# Altium schematic sheet PWM_I2C.SchDoc
size A
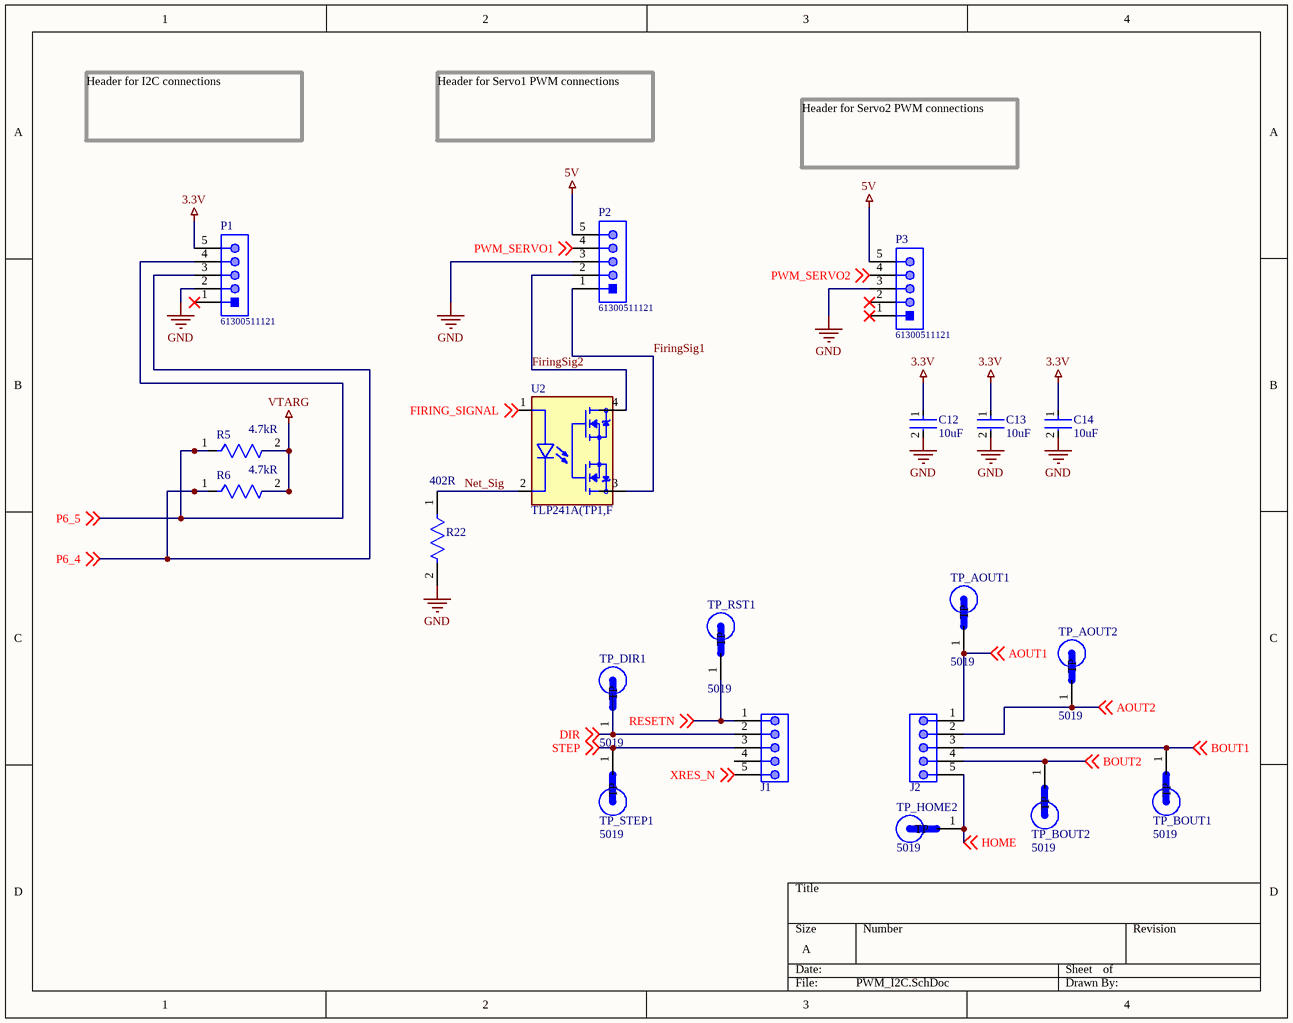
[diagram p0: PWM_I2C.SchDoc]

## Parts
C12  value 10uF  [FP-C0805C-DG-MFG]  (hidden comment: C0805C106K8PACTU)
C13  value 10uF  [FP-C0805C-DG-MFG]  (hidden comment: C0805C106K8PACTU)
C14  value 10uF  [FP-C0805C-DG-MFG]  (hidden comment: C0805C106K8PACTU)
J1  CONN_HEADER_MALE_1x5  [HDR1X5]  (value not drawn)
J2  CONN_HEADER_MALE_1x5  [HDR1X5]  (value not drawn)
P1  61300511121  [61300511121]
P2  61300511121  [61300511121]
P3  61300511121  [61300511121]
R5  Resistance: 4.7kR  [FP-RMCF0805-MFG]  (hidden comment: RMCF0805JT4K70)
R6  Resistance: 4.7kR  [FP-RMCF0805-MFG]  (hidden comment: RMCF0805JT4K70)
R22  Resistance: 402R  [FP-RMCF0805-IPC_C]  (hidden comment: RMCF0805FT402R)
TP_AOUT1  5019  [TP380X203]
TP_AOUT2  5019  [TP380X203]
TP_BOUT1  5019  [TP380X203]
TP_BOUT2  5019  [TP380X203]
TP_DIR1  5019  [TP380X203]
TP_HOME2  5019  [TP380X203]
TP_RST1  5019  [TP380X203]
TP_STEP1  5019  [TP380X203]
U2  TLP241A(TP1,F  [SOIC254P1000X425-4N]

## Nets
3.3V: C12.1 C13.1 C14.1 P1.5
5V: P2.5 P3.5
GND: C12.2 C13.2 C14.2 P1.2 P2.3 P3.3 R22.2
VTARG: R5.2 R6.2
AOUT1: J2.1 TP_AOUT1.1(TP) ; off-sheet AOUT1
AOUT2: J2.2 TP_AOUT2.1(TP) ; off-sheet AOUT2
BOUT1: J2.3 TP_BOUT1.1(TP) ; off-sheet BOUT1
BOUT2: J2.4 TP_BOUT2.1(TP) ; off-sheet BOUT2
DIR: J1.2 TP_DIR1.1(TP) ; off-sheet DIR
FIRING_SIGNAL: U2.1(A) ; off-sheet FIRING_SIGNAL
FiringSig1: P2.1 U2.3(D1)
FiringSig2: P2.2 U2.4(D2)
HOME: J2.5 TP_HOME2.1(TP) ; off-sheet HOME
Net_Sig: R22.1 U2.2(C)
P6_4: P1.3 R6.1 ; off-sheet P6_4
P6_5: P1.4 R5.1 ; off-sheet P6_5
PWM_SERVO1: P2.4 ; off-sheet PWM_SERVO1
PWM_SERVO2: P3.4 ; off-sheet PWM_SERVO2
RESETN: J1.1 TP_RST1.1(TP) ; off-sheet RESETN
STEP: J1.3 TP_STEP1.1(TP) ; off-sheet STEP
XRES_N: J1.5 ; off-sheet XRES_N

Not connected (* = marked no-connect by the designer): J1 4; P1 1*; P3 1* 2*

## Notes on the sheet
- Header for I2C connections
- Header for Servo1 PWM connections
- Header for Servo2 PWM connections

## Library data of the parts
C12-C14 = CMP-2007-03243-2: CAP CER 10UF 10V X5R 0805; Manufacturer: Kemet; 3DS Part Number: 220-00001; Tolerance: 10%; Temperature Coefficient: 15%; Material: Ceramic; Device Class L2: Capacitors; Device Class L1: Passive Components; ComponentLink2URL: https://content.kemet.com/datasheets/KEM_C1006_X5R_SMD.pdf; Height: 1.4mm; Lead Free: Yes; Manufacturer Part Number: C0805C106K8PACTU; Digikey Description: CAP CER 10UF 10V X5R 0805; Octopart: https://octopart.com/c0805c106k8pactu-kemet-98697; Capacitance: 10uF; Temperature Range Low: -55°C; Temperature: -55°C to +85°C; Automotive: No; Mouser Description: CAP CER 10UF 10V X5R 0805; Ipc Land Pattern Name: CAPC200125X125; Temperature Range High: +85°C; Voltage: 10V; RoHS: TRUE; Device Class L3: Ceramic Capacitors; ComponentLink2Description: Datasheet; Voltage Rating: 10V; Package: C0805C-DG; Temperature Characteristic: X5R; Category: Cap; Supplier 1: Digi-Key; Supplier Part Number 1: 399-C0805C106K8PAC7800CT-ND; Manufacturer 1: KEMET; Manufacturer Part Number 1: C0805C106K8PACTU; Stock 1: 8631846; Pricing 1: 1=0.14000, 10=0.10300, 50=0.05840, 100=0.04830, 500=0.03388, 1000=0.02805 (USD); Mount: Surface Mount; Case/Package: 0805; Number of Pins: 2; Case Code (Imperial): 0805; Case Code (Metric): 2012; Dielectric Material: Ceramic; Contact Plating: Tin,Matte; Min Operating Temperature: -55°C; Max Operating Temperature: 85°C; Packaging: Tape and Reel; Dielectric: X5R; Package Quantity: 1; Voltage Rating (DC): 10V; Series: C; Termination: SMD/SMT; Construction: Flat; Dissipation Factor: 10%; Length: 2mm; Width: 1.2mm; Depth: 1.25mm; Thickness: 0.055inch; Radiation Hardening: No; REACH SVHC: No SVHC; RoHS Compliant: Yes
J1 J2 = CONN_HEADER_MALE_1x5: Header, 5-Pin; Manufacturer 1: Sullins; Manufacturer Part Number 1: PREC005SACN-RC; Number of Positions: 5; Connector Type: Male Pin; Pitch: 0.1inch; ComponentLink1URL: http://www.farnell.com/cad/1737268.pdf; ComponentLink1Description: http://www.farnell.com/cad/1737268.pdf; ComponentLink2URL: http://katalog.we-online.de/em/datasheet/6130xx11121.pdf; ComponentLink2Description: http://katalog.we-online.de/em/datasheet/6130xx11121.pdf; Supplier 1: Digi-Key; Stock 1: 0; Pricing 1: 1=0.19000, 10=0.17400, 25=0.12960, 50=0.11120, 100=0.10740, 250=0.09264, 500=0.08892 (USD); RoHS: Yes; Mount: Through Hole; Color: Black; Contact Plating: Tin; Package Quantity: 1; Number of Rows: 1; Packaging: Bulk; Termination: Solder; Contact Mating Length: 0.23inch; ComponentLink3URL: https://datasheet.ciiva.com/741/xrxczzzsxxn-rc-st-11635-b-741840.pdf?src-supplier=Digi-Key; ComponentLink3Description: https://datasheet.ciiva.com/741/xrxczzzsxxn-rc-st-11635-b-741840.pdf?src-supplier=Digi-Key; Supplier Part Number 1: S1032EC-05-ND
P1-P3 = CMP-1502-01068-1: THT Vertical Pin Header WR-PHD, Pitch 2.54 mm, Single Row, 5 pins; Manufacturer: Wurth Elektronik; Manufacturer 1: Wurth Electronics; Pin Number: 5; Contact Resistance: 20mOhm; Working Voltage: 250VAC; Pitch: 2.54mm; Withstanding Voltage: 500VAC; Rated Current: 3A; Gender: Male; Connector Type: Male Pin; Datasheet URL: https://katalog.we-online.de/em/datasheet/6130xx11121.pdf; Orientation: Vertical; Mounting Technology: THT; Row Number: Single; Package Reference: 61300511121; Publisher: WurthElektronik; Part Number: 61300511121; Packaging: Bag; Manufacturer URL: http://www.we-online.de; Operating Temperature: -40to105degC; Supplier 1: Digi-Key; Supplier Part Number 1: 732-5318-ND; Manufacturer Part Number 1: 61300511121; RoHS: Yes; Category: Headers and Wire Housings; Stock 1: 41302; Pricing 1: 1=0.26000, 10=0.22200, 25=0.18520, 50=0.15500, 100=0.14100, 1000=0.12800 (USD); Mount: Through Hole; Contact Plating: Gold; Contact Material: Copper; Color: Black; Number of Rows: 1; Termination: Solder; Number of Contacts: 5; Number of Positions: 5; Contact Mating Length: 0.236inch; RoHS Compliant: Yes; REACH SVHC: Unknown; Lead Free: Lead Free; ComponentLink1URL: http://www.farnell.com/cad/1737268.pdf?src-supplier=Element14; ComponentLink1Description: http://www.farnell.com/cad/1737268.pdf?src-supplier=Element14; ComponentLink2URL: https://katalog.we-online.de/em/datasheet/6130xx11121.pdf?src-supplier=Digi-Key; ComponentLink2Description: https://katalog.we-online.de/em/datasheet/6130xx11121.pdf?src-supplier=Digi-Key
R5 R6 = CMP-26527-003538-1: 4.7kΩ ±5% 0.125W 0805 Thick Film Chip Resistor AEC-Q200 compliant; Manufacturer: Stackpole Electronics; Temperature Coefficient: 100ppm/°C; Max Power Dissipation: 125mW; Size Code: 0805; Case/Package: 0805; Mount: Surface Mount; RoHS Compliant: Yes; Height: 0.026inch; Case Code (Imperial): 0805; Military Standard: Not; Contact Plating: Tin; Length: 2mm; Resistor Type: Thick Film; Tolerance: 5%; Depth: 1.25mm; Radiation Hardening: No; Min Operating Temperature: -55°C; Number of Terminations: 2; Width: 0.049inch; Lead Free: Lead Free; Case Code (Metric): 2012; Construction: Rectangular; Packaging: Tape and Reel; Features: Automotive AEC-Q200; Power Rating: 125mW; Max Operating Temperature: 155°C; Series: RMCF; Supplier 1: Digi-Key; Supplier Part Number 1: RMCF0805JT4K70CT-ND; Manufacturer Part Number: RMCF0805JT4K70; RoHS: Yes; Category: Chip SMD Resistors; Stock 1: 1600707; Pricing 1: 1=0.10000, 10=0.01800, 100=0.00730, 1000=0.00328, 2500=0.00284 (USD); ComponentLink1URL: https://www.seielect.com/catalog/SEI-RMCF_RMCP.pdf?src-supplier=Avnet; ComponentLink1Description: https://www.seielect.com/catalog/SEI-RMCF_RMCP.pdf?src-supplier=Avnet; ComponentLink2URL: http://components.arrow.com/part/dataview/50568259S6926486N1174?src-supplier=Arrow+Electronics; ComponentLink2Description: http://components.arrow.com/part/dataview/50568259S6926486N1174?src-supplier=Arrow+Electronics; ComponentLink3URL: http://www.seielect.com/catalog/sei-rmc.pdf?src-supplier=Future+Electronics; ComponentLink3Description: http://www.seielect.com/catalog/sei-rmc.pdf?src-supplier=Future+Electronics; ComponentLink4URL: https://www.verical.com/server-webapp/html/getDatasheet?partID=364261&src-supplier=Verical; ComponentLink4Description: https://www.verical.com/server-webapp/html/getDatasheet?partID=364261&src-supplier=Verical; ComponentLink5URL: https://www.seielect.com/catalog/SEI-Packaging.pdf?src-supplier=Digi-Key; ComponentLink5Description: https://www.seielect.com/catalog/SEI-Packaging.pdf?src-supplier=Digi-Key
R22 = CMP-26527-001052-1: 402Ω ±1% 0.125W 0805 Thick Film Chip Resistor AEC-Q200 compliant; Manufacturer: Stackpole Electronics; Temperature Coefficient: 100ppm/°C; Radiation Hardening: No; RoHS Compliant: Yes; Contact Plating: Tin; Tolerance: 1%; Max Operating Temperature: 155°C; Min Operating Temperature: -55°C; Lead Free: Lead Free; Resistor Type: Thick Film; Mount: Surface Mount; Case/Package: 0805; Packaging: Tape and Reel; Supplier 1: Digi-Key; Supplier Part Number 1: RMCF0805FT402RCT-ND; Manufacturer Part Number: RMCF0805FT402R; RoHS: Yes; Category: Chip SMD Resistors; Stock 1: 94446; Pricing 1: 1=0.10000, 10=0.02400, 100=0.00970, 1000=0.00437, 2500=0.00379 (USD); ComponentLink1URL: http://components.arrow.com/part/dataview/50506660S7153955N1174?src-supplier=Arrow+Electronics; ComponentLink1Description: http://components.arrow.com/part/dataview/50506660S7153955N1174?src-supplier=Arrow+Electronics; ComponentLink2URL: https://www.seielect.com/catalog/SEI-RMCF_RMCP.pdf?src-supplier=Avnet; ComponentLink2Description: https://www.seielect.com/catalog/SEI-RMCF_RMCP.pdf?src-supplier=Avnet; ComponentLink3URL: https://www.seielect.com/catalog/sei-rmcf_rmcp.pdf?src-supplier=Digi-Key; ComponentLink3Description: https://www.seielect.com/catalog/sei-rmcf_rmcp.pdf?src-supplier=Digi-Key; ComponentLink4URL: https://www.seielect.com/catalog/SEI-Packaging.pdf?src-supplier=Digi-Key; ComponentLink4Description: https://www.seielect.com/catalog/SEI-Packaging.pdf?src-supplier=Digi-Key
TP_AOUT1 TP_AOUT2 TP_BOUT1 TP_BOUT2 TP_DIR1 TP_HOME2 TP_RST1 TP_STEP1 = 5019: PC Test Point, Miniature Phosphor Bronze, Silver Plating Surface Mount Mounting Type; MF: Keystone Electronics; Value: *; MP: 5019; Package: 2010 Keystone; SnapEDA_Link: https://www.snapeda.com/parts/5019/Keystone%20Electronics/view-part/449144/?ref=snap; Digi-Key_Part_Number: 36-5019CT-ND; Digi-Key_Purchase_URL: https://www.digikey.com/product-detail/en/keystone-electronics/5019/36-5019CT-ND/3907344?utm_source=snapeda&utm_medium=aggregator&utm_campaign=symbol
U2 = TLP241A(TP1,F: Relay Ssr 25MA 1.4V Dc-in 2A 40V Dc-out 4-PIN DIP T/r; Manufacturer: Toshiba; MF: Toshiba Semiconductor; Package: SMD-4 Toshiba; Price: None; Check_prices: https://www.snapeda.com/parts/TLP241A(TP1,F/Toshiba%20Semiconductor%20and%20Storage/view-part/1132983/?ref=eda; SnapEDA_Link: https://www.snapeda.com/parts/TLP241A(TP1,F/Toshiba%20Semiconductor%20and%20Storage/view-part/1132983/?ref=snap; Availability: Bad; Value: *; MP: TLP241A(TP1,F; Supplier 1: Digi-Key; Supplier Part Number 1: TLP241A(TP1FCT-ND; Manufacturer Part Number: TLP241A(TP1,F; RoHS: Yes; Category: Solid State Relays; Stock 1: 11386; Pricing 1: 1=1.85000, 10=1.23200, 100=0.94800, 500=0.85696 (USD); Number of Pins: 4; RoHS Compliant: Yes; ComponentLink1URL: https://toshiba.semicon-storage.com/info/docget.jsp?did=14237&prodName=TLP241A&src-supplier=Digi-Key; ComponentLink1Description: https://toshiba.semicon-storage.com/info/docget.jsp?did=14237&prodName=TLP241A&src-supplier=Digi-Key